# Altium project TS_24_Brake Module.PrjPcb
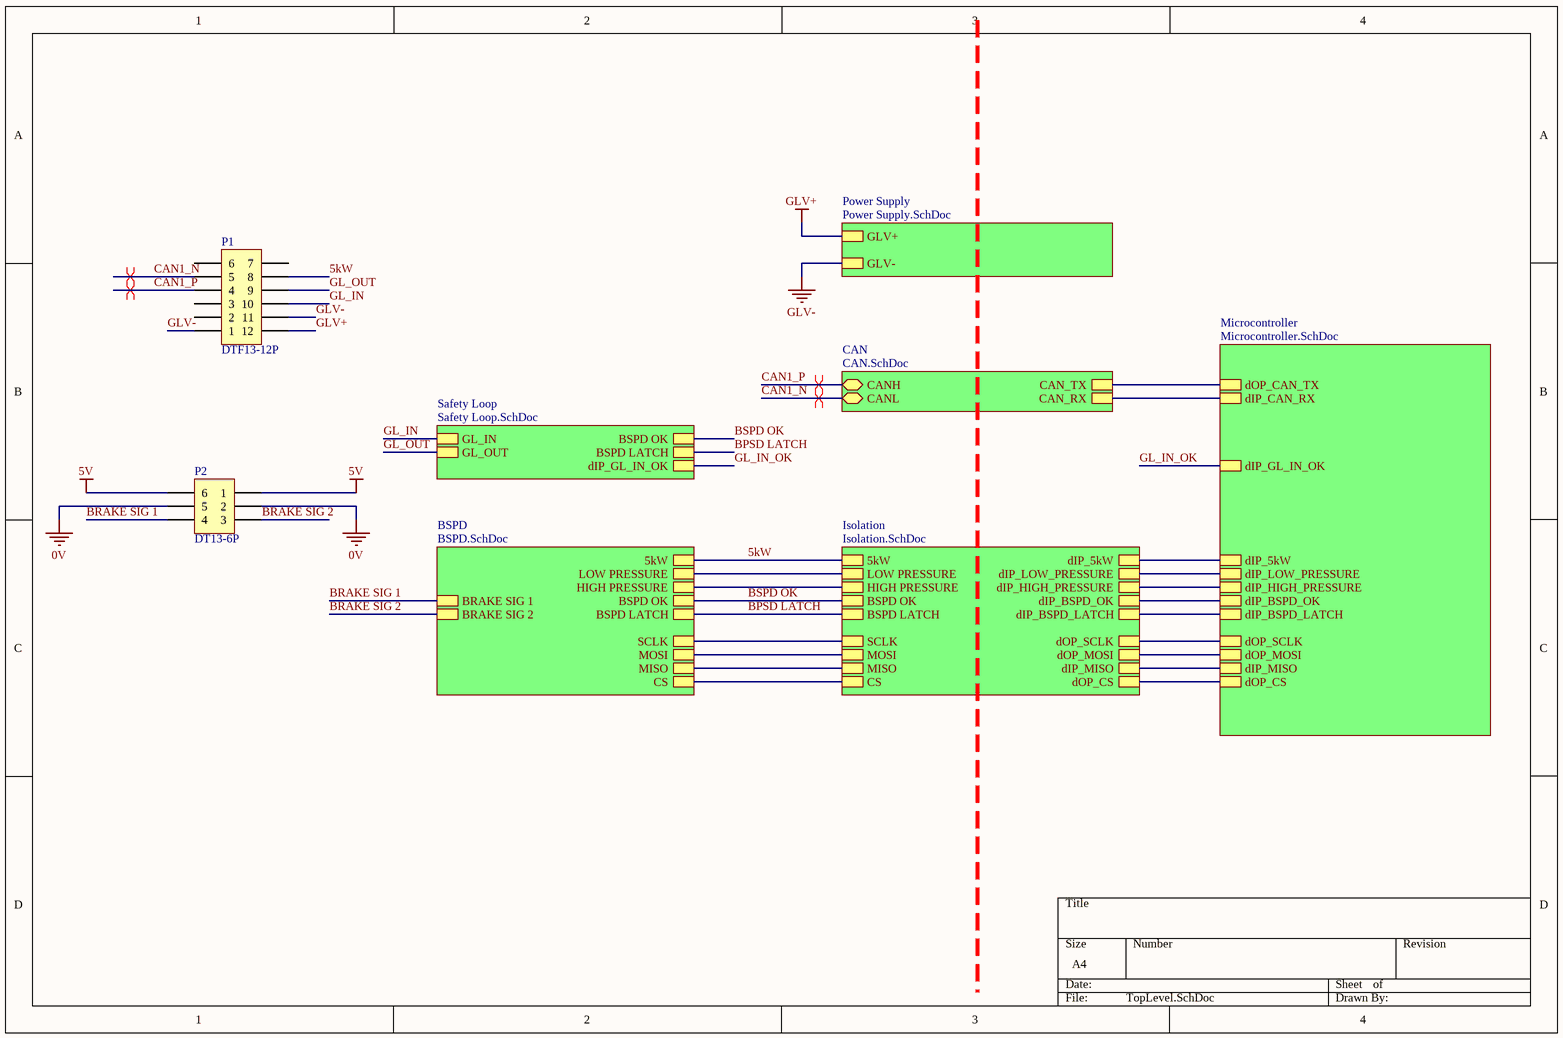
[diagram p0: TopLevel.SchDoc]
7 sheets, 116 parts. Net scope: hierarchical (ports join the sheet entries above them; power ports are global).
Board files: Brake Module A Sample.PcbDoc, Brake Module B1 Sample.PcbDoc, Brake Module B2 Sample.PcbDoc, Brake Module B4.PcbDoc
Sheets:
  TopLevel.SchDoc
    Power Supply = Power Supply.SchDoc
    CAN = CAN.SchDoc
    Isolation = Isolation.SchDoc
    BSPD = BSPD.SchDoc
    Microcontroller = Microcontroller.SchDoc
    Safety Loop = Safety Loop.SchDoc

## Sheet TopLevel.SchDoc
size A4; SheetNumber: 1; SheetTotal: 7

### Parts
P1  DTF13-12P  [DTF13-12P]
P2  DT13-6P  [DTF13-6P]

### Sub-sheets
BSPD = BSPD.SchDoc: 5kW, BSPD OK, BSPD LATCH, SCLK, MOSI, MISO, CS, BRAKE SIG 1, BRAKE SIG 2, HIGH PRESSURE, LOW PRESSURE
CAN = CAN.SchDoc: CANH (bidir), CANL (bidir), CAN_TX, CAN_RX
Isolation = Isolation.SchDoc: 5kW, BSPD OK, BSPD LATCH, SCLK, MOSI, MISO, CS, HIGH PRESSURE, LOW PRESSURE, dIP_5kW, dIP_LOW_PRESSURE, dIP_HIGH_PRESSURE, dIP_BSPD_OK, dIP_BSPD_LATCH, dOP_CS, dOP_MOSI, dIP_MISO, dOP_SCLK
Microcontroller = Microcontroller.SchDoc: dOP_CAN_TX, dIP_CAN_RX, dIP_5kW, dIP_LOW_PRESSURE, dIP_HIGH_PRESSURE, dIP_BSPD_OK, dIP_BSPD_LATCH, dOP_SCLK, dOP_MOSI, dIP_MISO, dOP_CS, dIP_GL_IN_OK
Power Supply = Power Supply.SchDoc: GLV+, GLV-
Safety Loop = Safety Loop.SchDoc: BSPD OK, BSPD LATCH, GL_IN, GL_OUT, dIP_GL_IN_OK

### Nets
0V: P2.2 P2.5
5V: P2.1 P2.6
GLV+: P1.12 ; sheet Power Supply/GLV+
GLV-: P1.1 P1.11 ; sheet Power Supply/GLV-
5kW: P1.8 ; sheet Isolation/5kW, sheet BSPD/5kW
BPSD LATCH: sheet Isolation/BSPD LATCH, sheet BSPD/BSPD LATCH, sheet Safety Loop/BSPD LATCH
BRAKE SIG 1: P2.4 ; sheet BSPD/BRAKE SIG 1
BRAKE SIG 2: P2.3 ; sheet BSPD/BRAKE SIG 2
BSPD OK: sheet Isolation/BSPD OK, sheet BSPD/BSPD OK, sheet Safety Loop/BSPD OK
CAN1_N: P1.5 ; sheet CAN/CANL
CAN1_P: P1.4 ; sheet CAN/CANH
CS (ADC): sheet Isolation/CS, sheet BSPD/CS
GL_IN: P1.10 ; sheet Safety Loop/GL_IN
GL_IN_OK: sheet Microcontroller/dIP_GL_IN_OK, sheet Safety Loop/dIP_GL_IN_OK
GL_OUT: P1.9 ; sheet Safety Loop/GL_OUT
NetADC1_12: sheet Isolation/MISO, sheet BSPD/MISO
NetADC1_13: sheet Isolation/SCLK, sheet BSPD/SCLK
NetADC1_14: sheet Isolation/MOSI, sheet BSPD/MOSI
NetR9_1: sheet CAN/CAN_RX, sheet Microcontroller/dIP_CAN_RX
NetR10_1: sheet CAN/CAN_TX, sheet Microcontroller/dOP_CAN_TX
NetR24_1: sheet Isolation/HIGH PRESSURE, sheet BSPD/HIGH PRESSURE
NetR25_1: sheet Isolation/LOW PRESSURE, sheet BSPD/LOW PRESSURE
NetR34_1: sheet Isolation/dOP_CS, sheet Microcontroller/dOP_CS
NetU7_9: sheet Isolation/dIP_BSPD_OK, sheet Microcontroller/dIP_BSPD_OK
NetU7_10: sheet Isolation/dIP_BSPD_LATCH, sheet Microcontroller/dIP_BSPD_LATCH
NetU7_12: sheet Isolation/dOP_SCLK, sheet Microcontroller/dOP_SCLK
NetU7_13: sheet Isolation/dIP_MISO, sheet Microcontroller/dIP_MISO
NetU7_14: sheet Isolation/dOP_MOSI, sheet Microcontroller/dOP_MOSI
NetU7_15: sheet Isolation/dIP_5kW, sheet Microcontroller/dIP_5kW
NetU7_16: sheet Isolation/dIP_HIGH_PRESSURE, sheet Microcontroller/dIP_HIGH_PRESSURE
NetU7_17: sheet Isolation/dIP_LOW_PRESSURE, sheet Microcontroller/dIP_LOW_PRESSURE

Not connected (* = marked no-connect by the designer): P1 2 3 6 7

### Layout directives
differential pair: CAN1_N, CAN1_P

### Library data of the parts
P1 = DTF13-12P: Positions: 12; Pitch: 4.45mm; Angle: 90; Flange: No; Contact: Copper Alloy; Part Number: DTF13-12P; Row Spacing: 4.45mm; Digikey Part Number: 1734-1861-ND; Digikey Link: https://www.digikey.com/products/en?keywords=dtf13-12pa
P2 = DTF13-6P: Positions: 6; Pitch: 4.45mm; Angle: 90; Flange: No; Contact: Copper Alloy; Part Number: DTF13-6P; Row Spacing: 4.45mm; Digikey Part Number: 1734-1754-ND; Digikey Link: https://www.digikey.com/products/en?keywords=DTF13-6P

## Sheet Power Supply.SchDoc
size A4; SheetNumber: 2; SheetTotal: 7
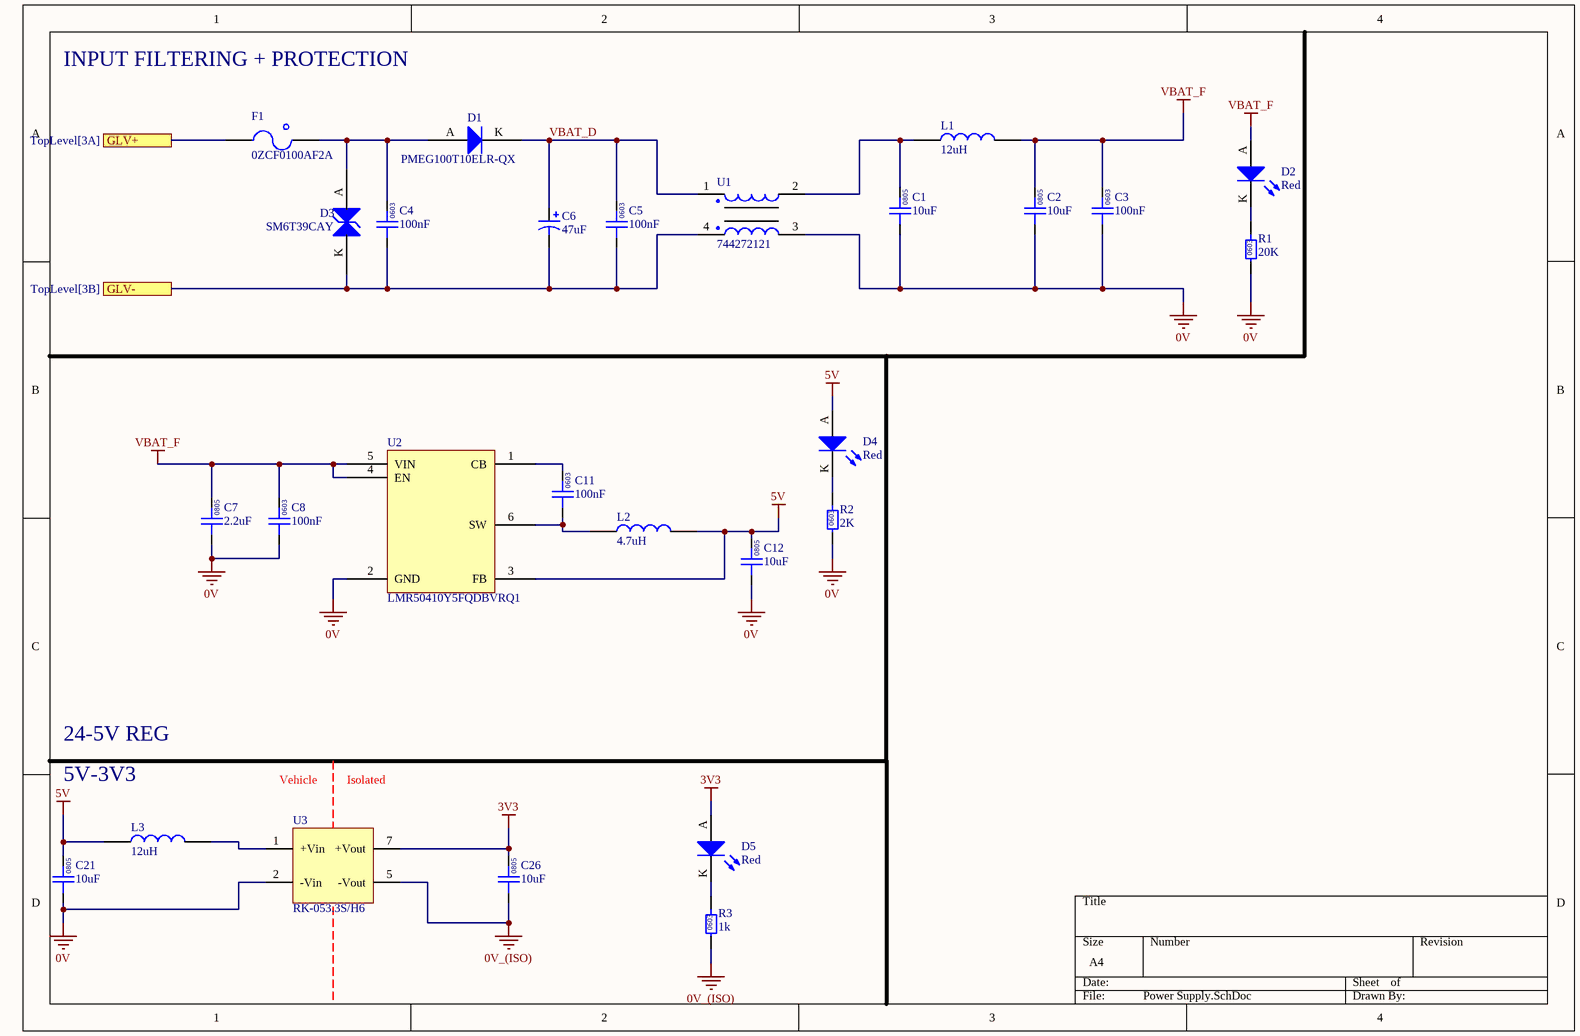
[diagram p1: Power Supply.SchDoc]

### Parts
C1  10uF  [0805]
C2  10uF  [0805]
C3  100nF  [0603]
C4  100nF  [0603]
C5  100nF  [0603]
C6  47uF  [CHEMI-CON ELCO]
C7  2.2uF  [0805]
C8  100nF  [0603]
C11  100nF  [0603]
C12  10uF  [0805]
C21  10uF  [0805]
C26  10uF  [0805]
D1  PMEG100T10ELR-QX  [SODFL350X110-2N]
D2  Red  [0805 LED]
D3  SM6T39CAY  [SM6T39CAY-Footprint-1]
D4  Red  [0805 LED]
D5  Red  [0805 LED]
F1  0ZCF0100AF2A  [2920]
L1  12uH  [1812]
L2  4.7uH  [SRN3015TA-4R7M]
L3  12uH  [1812]
R1  20K  [0603]
R2  2K  [0603]
R3  1k  [0603]
U1  744272121  [Wurth 4-PC Pad]
U2  LMR50410Y5FQDBVRQ1  [TI-SOT23-6]
U3  RK-053.3S/H6  [RK-053.3S/H6]

### Ports
GLV+ (see TopLevel[3A]), GLV- (see TopLevel[3B])

### Nets
0V: C1.1 C2.1 C3.1 C7.1 C8.1 C12.1 C21.1 R1.1 R2.1 U1.3 U2.2(GND) U3.2(-Vin)
0V_(ISO): C26.1 R3.1 U3.5(-Vout)
3V3: C26.2 D5.A U3.7(+Vout)
5V: C12.2 C21.2 D4.A L2.1 L3.2 U2.3(FB)
GLV+: F1.1 ; port GLV+
GLV-: C4.1 C5.1 C6.1 D3.K U1.4 ; port GLV-
VBAT_F: C2.2 C3.2 C7.2 C8.2 D2.A L1.1 U2.4(EN) U2.5(VIN)
VBAT_D: C5.2 C6.2 D1.K U1.1
NetC1_2: C1.2 L1.2 U1.2
NetC4_2: C4.2 D1.A D3.A F1.2
NetC11_1: C11.1 L2.2 U2.6(SW)
NetC11_2: C11.2 U2.1(CB)
NetD2_K: D2.K R1.2
NetD4_K: D4.K R2.2
NetD5_K: D5.K R3.2
NetL3_1: L3.1 U3.1(+Vin)

### Notes on the sheet
- INPUT FILTERING + PROTECTION
- 24-5V REG
- 5V-3V3
- Vehicle
- Isolated
- (in symbol GCM188L81H104KA57D) 0603
- (in symbol GRM21BR6YA106KE43L) 0805
- (in symbol GRM21BR61A226ME51L) 0805
- (in symbol RC0603FR-071KL) 0603
- (in symbol RC0603FR-072KL) 0603
- (in symbol RC0603FR-0720KL) 0603

### Library data of the parts
C1 C2 C12 C21 C26 = GRM21BR6YA106KE43L: Manufacturer: muRata; Rated Voltage: 50V; Tolerance: 10%; Material: MLCC; Temperature Rating: X5R; Part Number: GRM21BR6YA106KE43L; Value: 10uF; Digikey Part Number: 490-10514-6-ND
C3-C5 C8 C11 = GCM188L81H104KA57D: Manufacturer: muRata; Rated Voltage: 50V; Tolerance: ±10%; Material: MLCC; Temperature Rating: X8L; Part Number: GCM188L81H104KA57D; Value: 100nF; Digikey Part Number: 490-6049-1-ND
C6 = HHXA350ARA470MF61G: Part Number: HHXA350ARA470MF61G
C7 = GRM21BR61A226ME51L: Manufacturer: muRata; Value: 22uF; Rated Voltage: 50V; Tolerance: 20%; Material: MLCC; Temperature Rating: X5R; Part Number: GRM21BR61A226ME51L; Digikey Part Number: 490-10511-1-ND
D1 = CMP-004-00005-4: Diode 100 V 1A Surface Mount SOD-123W
D2 D4 D5 = SML-210LTT86: Red LED Indication - Discrete 1.75V 0805 (2012 Metric); Manufacturer: ROHM Semiconductor; Part Number: SML-210LTT86; Colour: Red; Digikey Part Number: 511-1286-1-ND
D3 = CMP-004-00003-4: TVS Diode Single Bi-Dir 33.3V 600W Automotive 2-Pin SMB T/R / TVS DIODE 33.3VWM 69.7VC SMB; Peak Pulse Current: 57A; Polarity: Bidirectional; Min Breakdown Voltage: 37.1V; Test Current: 1mA; Number of Elements: 1; Operating Supply Voltage: 30V; Diode Type: ZENER; Clamping Voltage: 53.9V; Leakage Current: 200nA; Power Line Protection: No; Max Surge Current: 11.1A; Max Breakdown Voltage: 41V; Breakdown Voltage: 39V; Max Power Dissipation: 600W; Radiation Hardening: No; Resistor Type: Zener; Termination: SMD/SMT; REACH SVHC: No SVHC; Reverse Breakdown Voltage: 37.1V; Max Operating Temperature: 150°C; Min Operating Temperature: -55°C; Element Configuration: Single; Length: 4.6mm; Case/Package: DO-214AA; Reverse Standoff Voltage: 33.3V; Number of Bidirectional Channels: 1; Number of Pins: 2; Direction: Bidirectional; Mount: Surface Mount; Package Quantity: 1; Width: 3.95mm; RoHS Compliant: Yes; Number of Channels: 1; Packaging: Tape and Reel; Max Reverse Leakage Current: 200nA; Peak Pulse Power: 600W; Height: 2.45mm; Series: Automotive, AEC-Q101, SM6TY, TRANSIL™
F1 = 0ZCF0100AF2A: PTC RESET FUSE 60V 1A 292; Manufacturer: Littelfuse Inc.; Part Number: 0ZCF0100AF2A; Digikey Part Number: 507-2070-1-ND; Digikey Link: https://www.digikey.com/product-detail/en/bel-fuse-inc/0ZCF0100AF2A/507-2070-1-ND/6210547
L1 L3 = RLS-126: Manufacturer: Recom; Tolerance: 0.2; Impedance: 230mOhm; Rated Current: 0.8 A; Material: Wirewound; Part Number: RLS-126; Value: 12uH; Digikey Part Number: 945-3429-ND
L2 = SRN4018-4R7M: Manufacturer: Bourns; Tolerance: 0.2; Impedance: 84mOhms; Rated Current: 1.9A; Material: Wirewound; Part Number: SRN4018-4R7M; Value: 4.7uH; Digikey Part Number: SRN3015TA-4R7MCT-ND
R1 = RC0603FR-0720KL: Manufacturer: YAGEO; Tolerance: 0.01; Rated Power: 0.1W; Part Number: RC0603FR-0720KL; Value: 20K; Digikey Part Number: 311-20.0KHRCT-ND; Material: FR-07
R2 = RC0603FR-072KL: Manufacturer: YAGEO; Tolerance: 0.01; Rated Power: 0.1W; Part Number: RC0603FR-072KL; Value: 2K; Digikey Part Number: 311-2.00KHRCT-ND; Material: FR-07
R3 = RC0603FR-071KL: Manufacturer: YAGEO; Tolerance: 0.01; Rated Power: 0.1W; Part Number: RC0603FR-071KL; Value: 1k; Digikey Part Number: 311-1.00KHRCT-ND; Material: FR-07
U1 = 744272121: Manufacturer: Wurth Electronics Inc; Value: 120uH @ 100kHz; Impedance: 460 Ohms @ 30MHz; Rated Current: 2.5 A; Part Number: 744272121; Material: Wirewound; Digikey Part Number: 732-1489-1-ND
U2 = LMR50410-Q1: IC REG BUCK 5V 1A SOT23-6; Manufacturer: Texas Instruments; Input Voltage: 4-36V; Part Number: LMR50410-Q1; Output Voltage: 5V; Output Current: 1A; Digikey Part Number: 296-LMR50410Y5FQDBVRQ1CT-ND
U3 = RK-053.3S/H6: DC DC CONVERTER 3.3V 1W; Manufacturer: Recom; Input Voltage: 5V; Output Current: 303mA; Part Number: RK-053.3S/H6; Output Voltage: 3.3V

## Sheet CAN.SchDoc
size A4; SheetNumber: 3; SheetTotal: 7
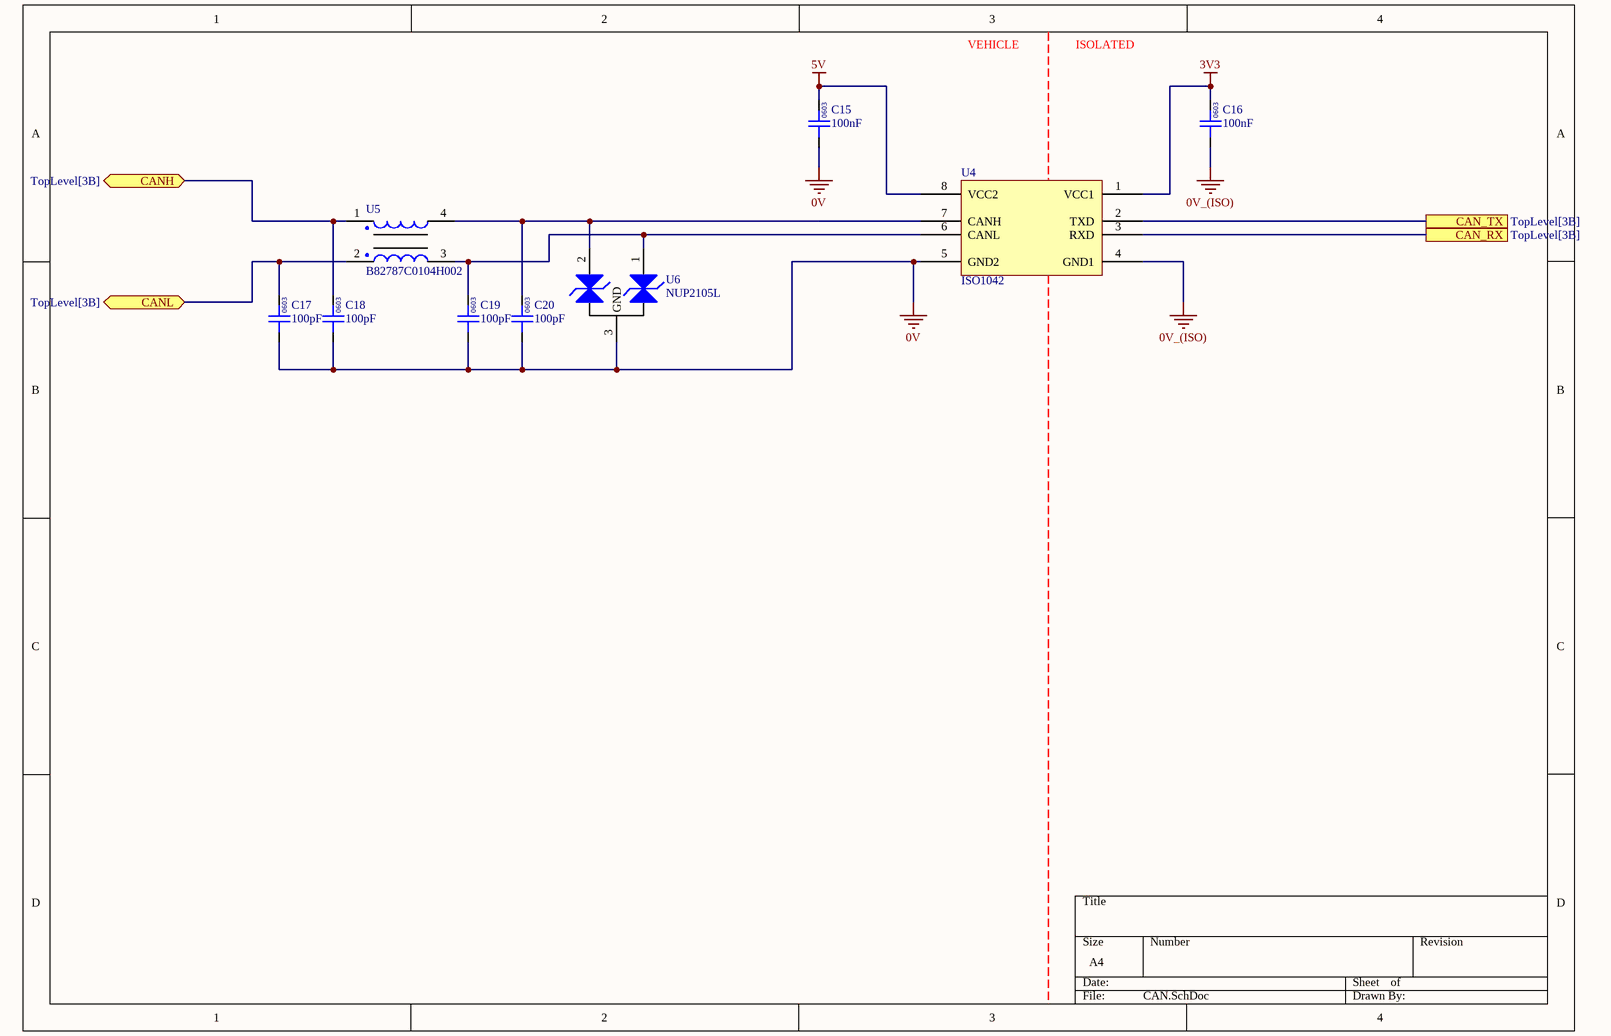
[diagram p2: CAN.SchDoc]

### Parts
C15  100nF  [0603]
C16  100nF  [0603]
C17  100pF  [0603]
C18  100pF  [0603]
C19  100pF  [0603]
C20  100pF  [0603]
U4  ISO1042  [TI-SOIC-8]
U5  B82787C0104H002  [TDK 4-PC Pad]
U6  NUP2105L  [ON SOT-23]

### Ports
CAN_RX (see TopLevel[3B]), CAN_TX (see TopLevel[3B]), CANH (bidir, see TopLevel[3B]), CANL (bidir, see TopLevel[3B])

### Nets
0V: C15.1 C17.1 C18.1 C19.1 C20.1 U4.5(GND2) U6.3(GND)
0V_(ISO): C16.1 U4.4(GND1)
3V3: C16.2 U4.1(VCC1)
5V: C15.2 U4.8(VCC2)
CAN1_N: C17.2 U5.2 ; port CANL
CAN1_P: C18.2 U5.1 ; port CANH
NetC19_2: C19.2 U4.6(CANL) U5.3 U6.1(CAN_H)
NetC20_2: C20.2 U4.7(CANH) U5.4 U6.2(CAN_L)
NetR9_1: U4.3(RXD) ; port CAN_RX
NetR10_1: U4.2(TXD) ; port CAN_TX

### Notes on the sheet
- VEHICLE
- ISOLATED
- (in symbol GCM188L81H104KA57D) 0603
- (in symbol GRM1885C1H101JA01D) 0603

### Library data of the parts
C15 C16 = GCM188L81H104KA57D: as C3 on sheet Power Supply; Part Number: GCM188L81H104KA57D; Value: 100nF; Digikey Part Number: 490-6049-1-ND
C17-C20 = GRM1885C1H101JA01D: Manufacturer: Murata Electronics; Rated Voltage: 50V; Tolerance: ±5%; Material: MLCC; Temperature Rating: C0G, NP0; Part Number: GRM1885C1H101JA01D; Value: 100pF; Digikey Part Number: 490-1427-1-ND
U4 = ISO1042: IC CAN TRANSCEIVER 1/1 8SOIC; Manufacturer: Texas Instruments; Part Number: ISO1042; Digikey Part Number: 296-ISO1042BQDWVQ1-ND
U5 = B82787C0104H002: Manufacturer: EPCOS (TDK); Value: 100µH @ 100kHz; Impedance: 5.8 kOhms @ 10MHz; Rated Current: 150mA; Part Number: B82787C0104H002; Material: Wirewound; Digikey Part Number: 495-4598-1-ND
U6 = NUP2105L: Dual Line CAN Bus Protector; Manufacturer: ON Semiconductor; Part Number: NUP2105L; Digikey Part Number: NUP2105LT1GOSCT-ND; Digikey Link: https://www.digikey.com/product-detail/en/on-semiconductor/NUP2105LT1G/NUP2105LT1GOSCT-ND/1485001

## Sheet Isolation.SchDoc
size A4; SheetNumber: 7; SheetTotal: 7
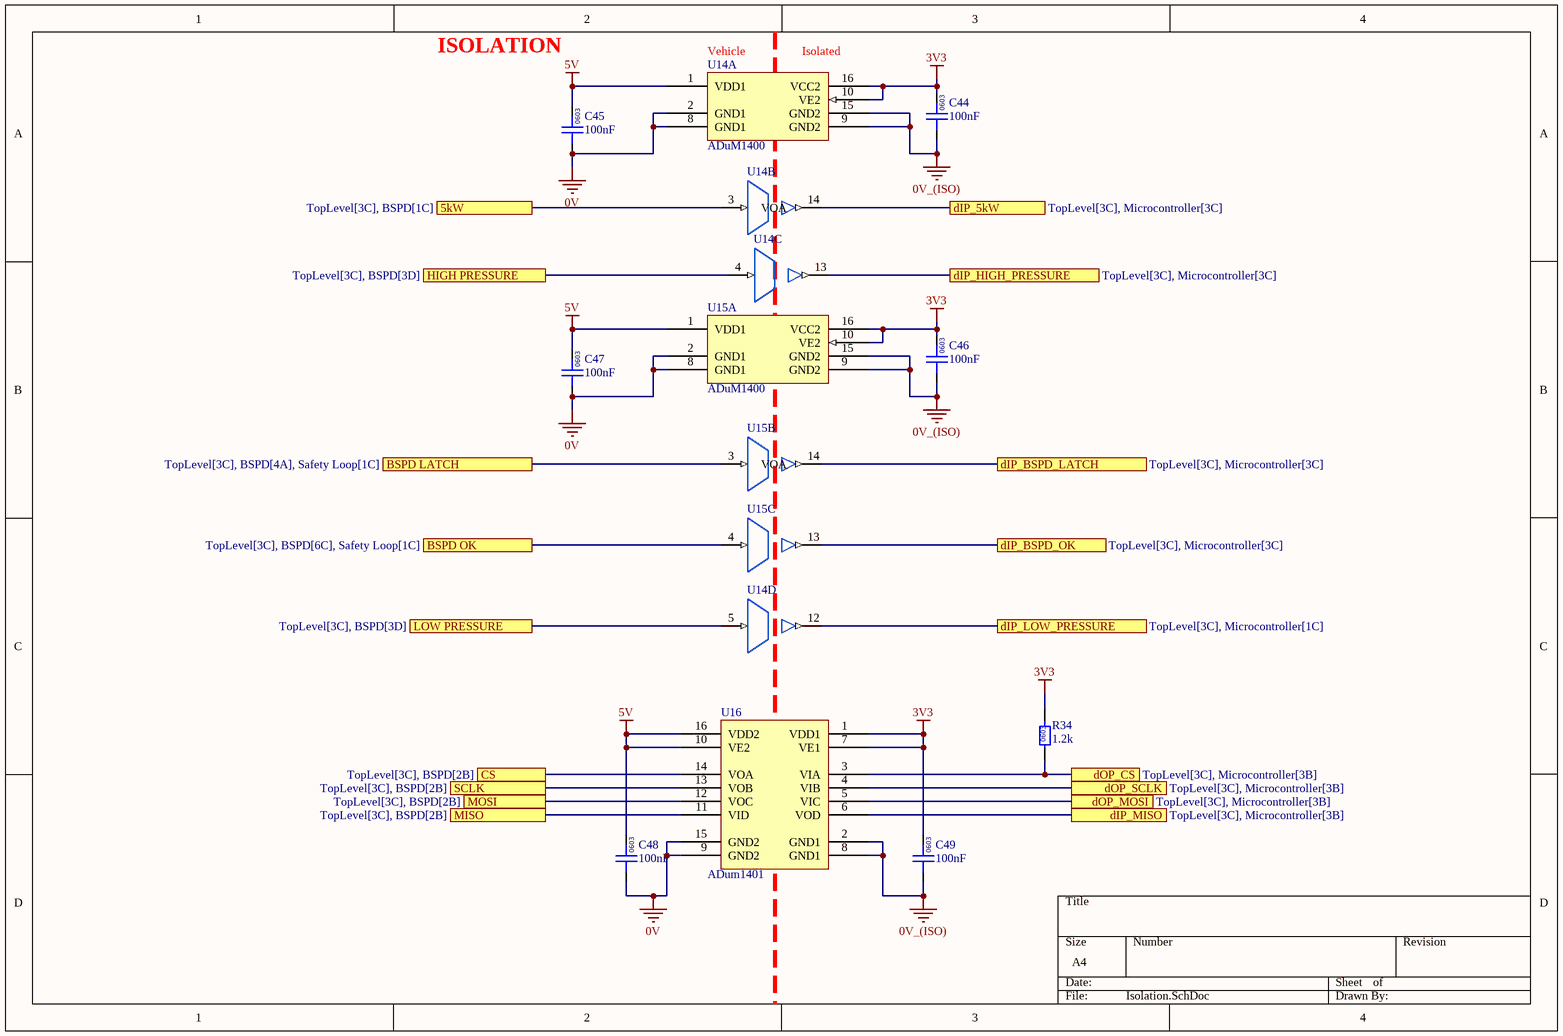
[diagram p3: Isolation.SchDoc]

### Parts
C44  100nF  [0603]
C45  100nF  [0603]
C46  100nF  [0603]
C47  100nF  [0603]
C48  100nF  [0603]
C49  100nF  [0603]
R34  1.2k  [0603]
U14  ADuM1400  [AD 16-SOIC]  (parts A,B,C,D of 5)
U15  ADuM1400  [AD 16-SOIC]  (parts A,B,C of 5)
U16  ADum1401  [AD 16-SOIC]

### Ports
5kW (see TopLevel[3C], BSPD[1C]), BSPD LATCH (see TopLevel[3C], BSPD[4A], Safety Loop[1C]), BSPD OK (see TopLevel[3C], BSPD[6C], Safety Loop[1C]), CS (see TopLevel[3C], BSPD[2B]), dIP_5kW (see TopLevel[3C], Microcontroller[3C]), dIP_BSPD_LATCH (see TopLevel[3C], Microcontroller[3C]), dIP_BSPD_OK (see TopLevel[3C], Microcontroller[3C]), dIP_HIGH_PRESSURE (see TopLevel[3C], Microcontroller[3C]), dIP_LOW_PRESSURE (see TopLevel[3C], Microcontroller[1C]), dIP_MISO (see TopLevel[3C], Microcontroller[3B]), dOP_CS (see TopLevel[3C], Microcontroller[3B]), dOP_MOSI (see TopLevel[3C], Microcontroller[3B]), dOP_SCLK (see TopLevel[3C], Microcontroller[3B]), HIGH PRESSURE (see TopLevel[3C], BSPD[3D]), LOW PRESSURE (see TopLevel[3C], BSPD[3D]), MISO (see TopLevel[3C], BSPD[2B]), MOSI (see TopLevel[3C], BSPD[2B]), SCLK (see TopLevel[3C], BSPD[2B])

### Nets
0V: C45.1 C47.1 C48.1 U14.2(GND1) U14.8(GND1) U15.2(GND1) U15.8(GND1) U16.9(GND2) U16.15(GND2)
0V_(ISO): C44.1 C46.1 C49.1 U14.9(GND2) U14.15(GND2) U15.9(GND2) U15.15(GND2) U16.2(GND1) U16.8(GND1)
3V3: C44.2 C46.2 C49.2 R34.2 U14.10(VE2) U14.16(VCC2) U15.10(VE2) U15.16(VCC2) U16.1(VDD1) U16.7(VE1)
5V: C45.2 C47.2 C48.2 U14.1(VDD1) U15.1(VDD1) U16.10(VE2) U16.16(VDD2)
5kW: U14.3(VIA) ; port 5kW
BPSD LATCH: U15.3(VIA) ; port BSPD LATCH
BSPD OK: U15.4(VIB) ; port BSPD OK
CS (ADC): U16.14(VOA) ; port CS
NetADC1_12: U16.11(VID) ; port MISO
NetADC1_13: U16.13(VOB) ; port SCLK
NetADC1_14: U16.12(VOC) ; port MOSI
NetR24_1: U14.4(VIB) ; port HIGH PRESSURE
NetR25_1: U14.5(VIC) ; port LOW PRESSURE
NetR34_1: R34.1 U16.3(VIA) ; port dOP_CS
NetU7_9: U15.13(VOB) ; port dIP_BSPD_OK
NetU7_10: U15.14(VOA) ; port dIP_BSPD_LATCH
NetU7_12: U16.4(VIB) ; port dOP_SCLK
NetU7_13: U16.6(VOD) ; port dIP_MISO
NetU7_14: U16.5(VIC) ; port dOP_MOSI
NetU7_15: U14.14(VOA) ; port dIP_5kW
NetU7_16: U14.13(VOB) ; port dIP_HIGH_PRESSURE
NetU7_17: U14.12(VOC) ; port dIP_LOW_PRESSURE

### Notes on the sheet
- ISOLATION
- (near U14) Vehicle
- (near U14) Isolated
- (in symbol GCM188L81H104KA57D) 0603
- (in symbol RC0603JR-071K2L) 0603

### Library data of the parts
C44-C49 = GCM188L81H104KA57D: as C3 on sheet Power Supply; Part Number: GCM188L81H104KA57D; Value: 100nF; Digikey Part Number: 490-6049-1-ND
R34 = RC0603JR-071K2L: Manufacturer: YAGEO; Tolerance: 0.01; Rated Power: 0.1W; Part Number: RC0603JR-071K2L; Value: 1.2k; Material: FR-07; Digikey Part Number: 311-1.2KGRCT-ND
U14 U15 = ADuM1400: General Purpose Digital Isolator 2500Vrms 4 Channel 1Mbps 25kV/µs CMTI 16-SOIC (0.295", 7.50mm Width); Manufacturer: Analog Devices; Part Number: ADuM1400; Digikey Part Number: ADUM1400WSRWZ-ND; Digikey Link: https://www.digikey.com/product-detail/en/analog-devices-inc/ADUM1400WSRWZ/ADUM1400WSRWZ-ND/1873713
U16 = ADuM1401: General Purpose Digital Isolator 2500Vrms 4 Channel 1Mbps 25kV/µs CMTI 16-SOIC (0.295", 7.50mm Width); Manufacturer: Analog Devices; Part Number: ADuM1401

## Sheet BSPD.SchDoc
size A3; SheetNumber: 5; SheetTotal: 7
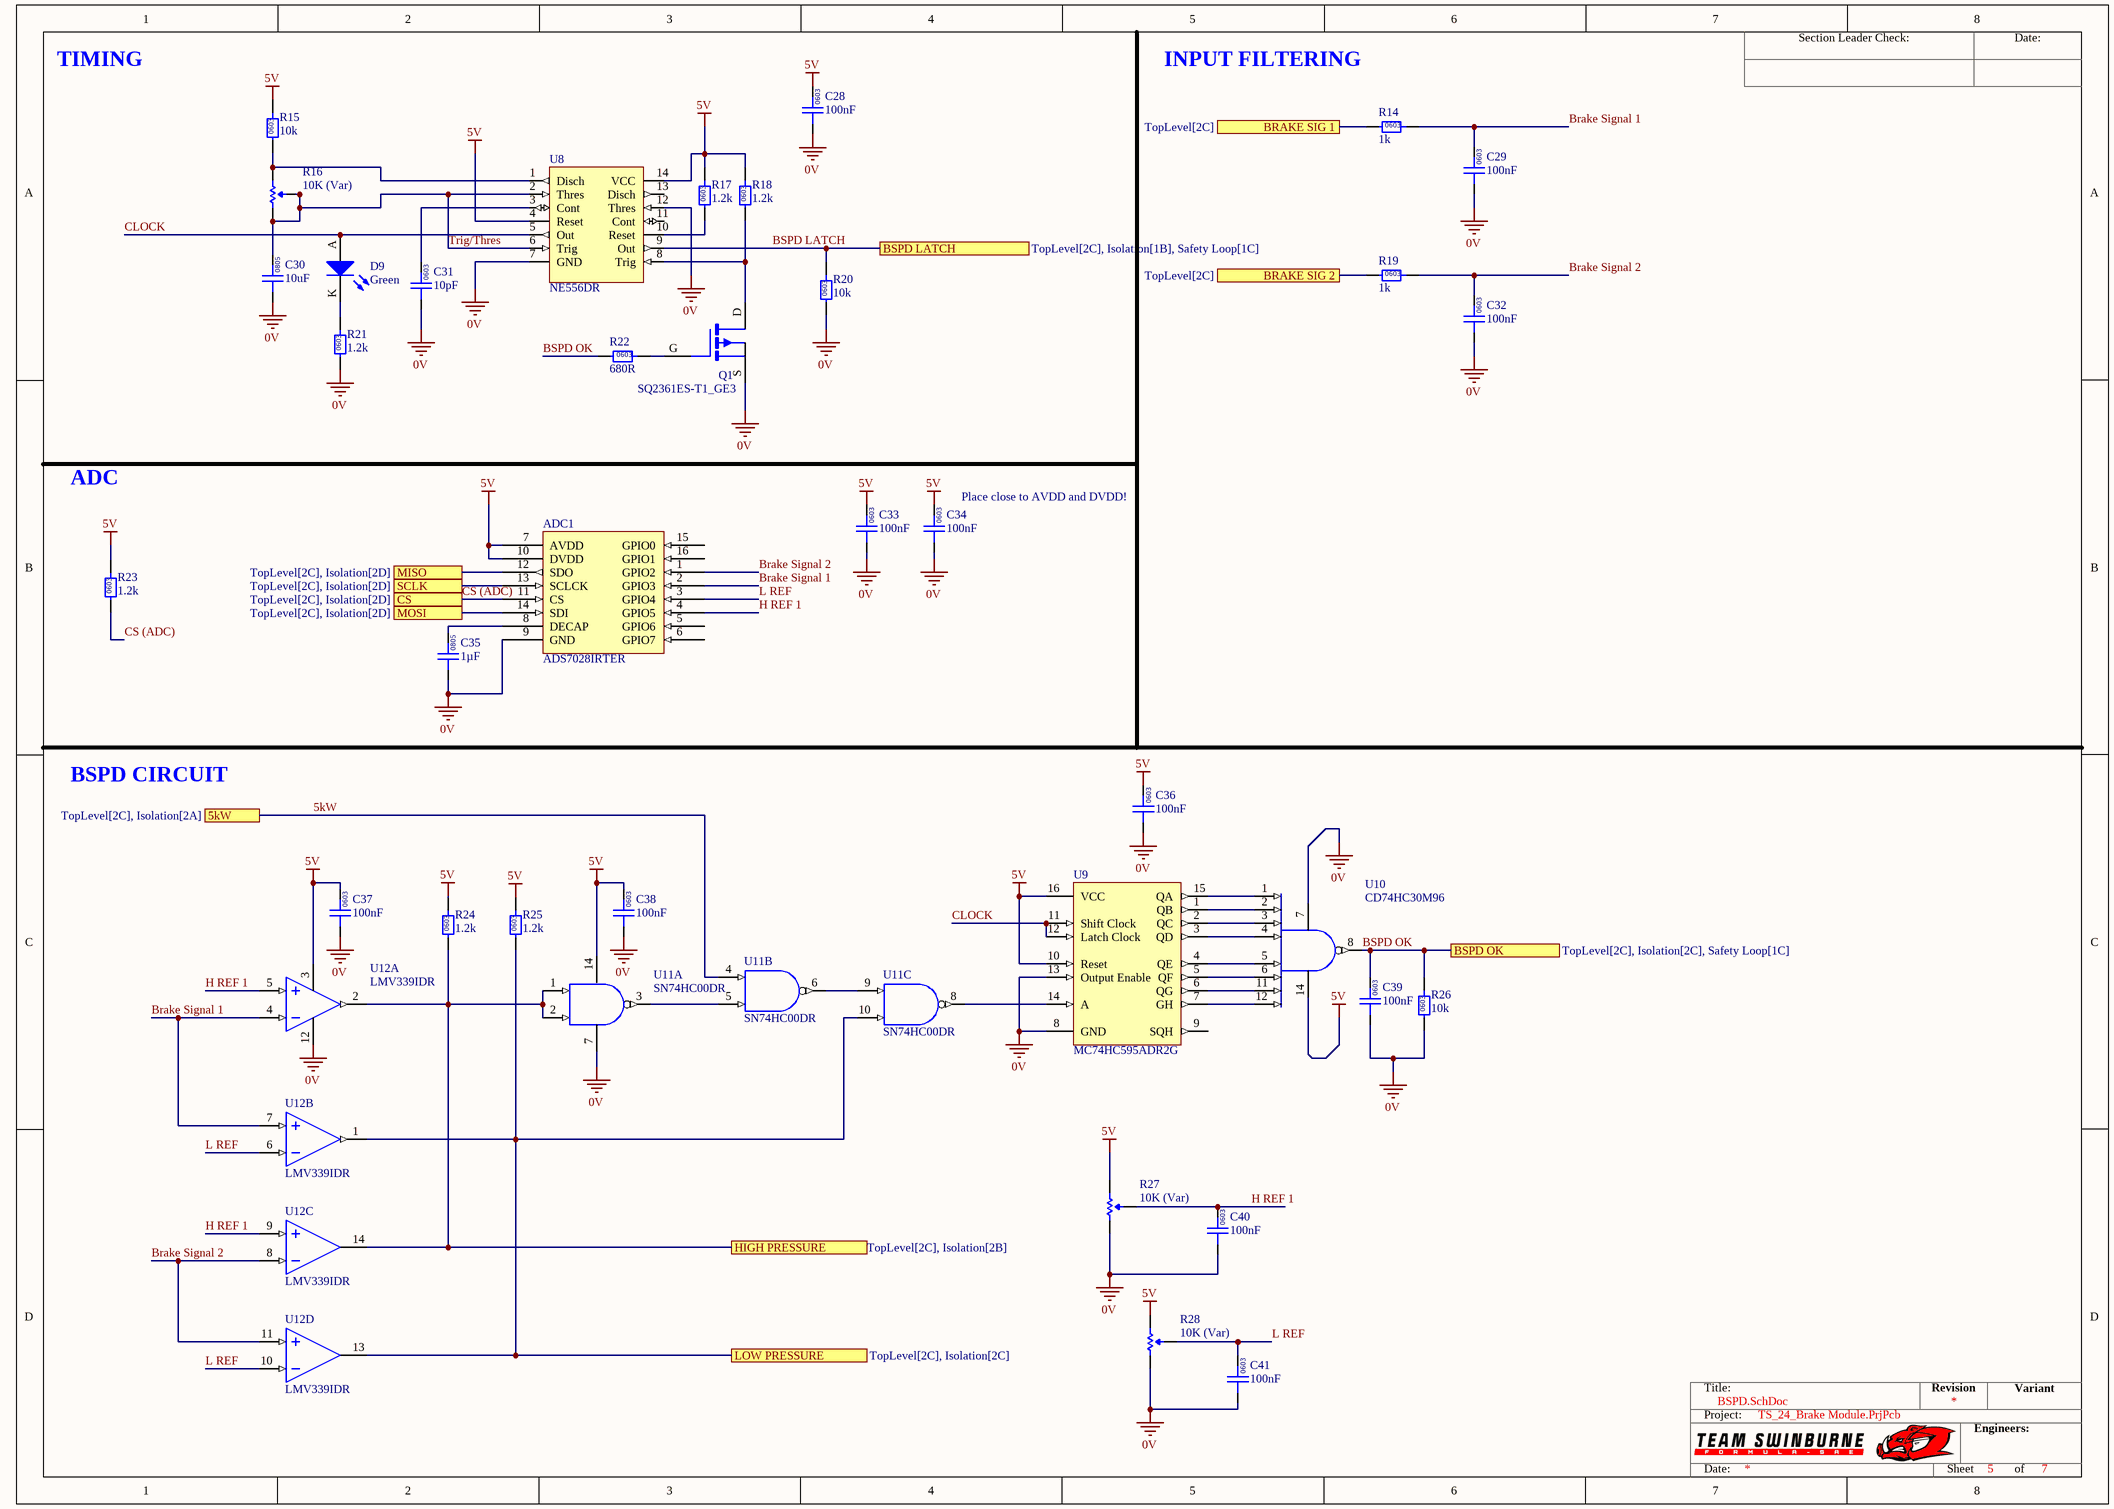
[diagram p4: BSPD.SchDoc]

### Parts
ADC1  ADS7028IRTER  [WFQN-16]
C28  100nF  [0603]
C29  100nF  [0603]
C30  10uF  [0805]
C31  10pF  [0603]
C32  100nF  [0603]
C33  100nF  [0603]
C34  100nF  [0603]
C35  1µF  [0805]
C36  100nF  [0603]
C37  100nF  [0603]
C38  100nF  [0603]
C39  100nF  [0603]
C40  100nF  [0603]
C41  100nF  [0603]
D9  Green  [0805 LED]
Q1  SQ2361ES-T1_GE3  [VSHY SOT-23-3]
R14  1k  [0603]
R15  10k  [0603]
R16  10K (Var)  [B 3296]
R17  1.2k  [0603]
R18  1.2k  [0603]
R19  1k  [0603]
R20  10k  [0603]
R21  1.2k  [0603]
R22  680R  [0603]
R23  1.2k  [0603]
R24  1.2k  [0603]
R25  1.2k  [0603]
R26  10k  [0603]
R27  10K (Var)  [3339P-1-1103LF]
R28  10K (Var)  [3339P-1-1103LF]
U8  NE556DR  [TI-SOIC14]
U9  MC74HC595ADR2G  [ON 16-SOIC]
U10  CD74HC30M96  [TI 14-SOIC]
U11  SN74HC00DR  [TI 14-SOIC]  (parts A,B,C of 4)
U12  LMV339IDR  [TI 14-SOIC]  (parts A,B,C,D of 4)

### Ports
5kW (see TopLevel[2C], Isolation[2A]), BRAKE SIG 1 (see TopLevel[2C]), BRAKE SIG 2 (see TopLevel[2C]), BSPD LATCH (see TopLevel[2C], Isolation[1B], Safety Loop[1C]), BSPD OK (see TopLevel[2C], Isolation[2C], Safety Loop[1C]), CS (see TopLevel[2C], Isolation[2D]), HIGH PRESSURE (see TopLevel[2C], Isolation[2B]), LOW PRESSURE (see TopLevel[2C], Isolation[2C]), MISO (see TopLevel[2C], Isolation[2D]), MOSI (see TopLevel[2C], Isolation[2D]), SCLK (see TopLevel[2C], Isolation[2D])

### Nets
0V: ADC1.9(GND) C28.1 C29.1 C30.1 C31.1 C32.1 C33.1 C34.1 C35.1 C36.1 C37.1 C38.1 C39.1 C40.1 C41.1 Q1.S R20.1 R21.1 R26.1 R27.3(CW) R28.3(CW) U8.7(GND) U8.12(Thres) U9.8(GND) U9.13(Output_Enable) U10.7(GND) U11.7(GND) U12.12(V-)
5V: ADC1.7(AVDD) ADC1.10(DVDD) C28.2 C33.2 C34.2 C36.2 C37.2 C38.2 R15.2 R17.2 R18.2 R23.2 R24.2 R25.2 R27.1(CCW) R28.1(CCW) U8.4(Reset) U8.14(VCC) U9.10(Reset) U9.16(VCC) U10.14(VCC) U11.14(VCC) U12.3(V+)
5kW: U11.4(2A) ; port 5kW
BRAKE SIG 1: R14.1 ; port BRAKE SIG 1
BRAKE SIG 2: R19.1 ; port BRAKE SIG 2
Brake Signal 1: ADC1.2(GPIO3) C29.2 R14.2 U12.4(IN_A-) U12.7(IN_B+)
Brake Signal 2: ADC1.1(GPIO2) C32.2 R19.2 U12.8(IN_C-) U12.11(IN_D+)
BSPD LATCH: R20.2 U8.9(Out) ; port BSPD LATCH  [project net BPSD LATCH]
BSPD OK: C39.2 R22.1 R26.2 U10.8(Output) ; port BSPD OK
CLOCK: D9.A U8.5(Out) U9.11(Shift_Clock) U9.12(Latch_Clock)
CS (ADC): ADC1.11(CS) R23.1 ; port CS
H REF 1: ADC1.4(GPIO5) C40.2 R27.2(Wiper) U12.5(IN_A+) U12.9(IN_C+)
L REF: ADC1.3(GPIO4) C41.2 R28.2(Wiper) U12.6(IN_B-) U12.10(IN_D-)
Trig/Thres: C30.2 R16.2(Wiper) R16.3(CW) U8.2(Thres) U8.6(Trig)
NetADC1_8: ADC1.8(DECAP) C35.2
NetADC1_12: ADC1.12(SDO) ; port MISO
NetADC1_13: ADC1.13(SCLCK) ; port SCLK
NetADC1_14: ADC1.14(SDI) ; port MOSI
NetC31_2: C31.2 U8.3(Cont)
NetD9_K: D9.K R21.2
NetQ1_D: Q1.D R18.1 U8.8(Trig)
NetQ1_G: Q1.G R22.2
NetR15_1: R15.1 R16.1(CCW) U8.1(Disch)
NetR17_1: R17.1 U8.10(Reset)
NetR24_1: R24.1 U11.1(1A) U11.2(1B) U12.2(OUT_A) U12.14(OUT_C) ; port HIGH PRESSURE
NetR25_1: R25.1 U11.10(3B) U12.1(OUT_B) U12.13(OUT_D) ; port LOW PRESSURE
NetU9_1: U9.1(QB) U10.2(Input)
NetU9_2: U9.2(QC) U10.3(Input)
NetU9_3: U9.3(QD) U10.4(Input)
NetU9_4: U9.4(QE) U10.5(Input)
NetU9_5: U9.5(QF) U10.6(Input)
NetU9_6: U9.6(QG) U10.11(Input)
NetU9_7: U9.7(GH) U10.12(Input)
NetU9_14: U9.14(A) U11.8(3Y)
NetU9_15: U9.15(QA) U10.1(Input)
NetU11_3: U11.3(1Y) U11.5(2B)
NetU11_6: U11.6(2Y) U11.9(3A)

Not connected (* = marked no-connect by the designer): ADC1 5(GPIO6) 6(GPIO7) 15(GPIO0) 16(GPIO1); U8 11(Cont) 13(Disch); U9 9(SQH)

### Notes on the sheet
- TIMING
- INPUT FILTERING
- ADC
- (near C34) Place close to AVDD and DVDD!
- BSPD CIRCUIT
- Section Leader Check:
- Date:
- Title:
- Revision
- Variant
- Project:
- Engineers:
- Sheet
- of
- (in symbol GCM21BR71H105KA03L) 0805
- (in symbol GCM188L81H104KA57D) 0603
- (in symbol GRM21BR6YA106KE43L) 0805
- (in symbol GRM1885C1H100JA01D) 0603
- (in symbol RC0603FR-071KL) 0603
- (in symbol RC0603FR-0710KL) 0603
- (in symbol RC0603JR-071K2L) 0603
- (in symbol RC0603JR-13680RL) 0603

### Library data of the parts
ADC1 = ADS7028IRTER: IC ADC 12BIT SAR 16WQFN; Manufacturer: Texas Instruments; Part Number: ADS7028IRTER; Digikey Part Number: ADS7028IRTER; Digikey Link: https://www.digikey.com.au/en/products/detail/texas-instruments/ADS7028IRTER/12696020?s=N4IgTCBcDaIIIBEDKB2ADGAHASQEoBUBRXEAXQF8g
C28 C29 C32-C34 C36-C41 = GCM188L81H104KA57D: as C3 on sheet Power Supply; Part Number: GCM188L81H104KA57D; Value: 100nF; Digikey Part Number: 490-6049-1-ND
C30 = GRM21BR6YA106KE43L: as C1 on sheet Power Supply; Part Number: GRM21BR6YA106KE43L; Value: 10uF; Digikey Part Number: 490-10514-6-ND
C31 = GRM1885C1H100JA01D: Manufacturer: Murata Electronics; Rated Voltage: 50V; Tolerance: ±5%; Material: MLCC; Temperature Rating: C0G, NP0; Part Number: GRM1885C1H100JA01D; Value: 10pF; Digikey Part Number: 490-1403-1-ND
C35 = GCM21BR71H105KA03L: Manufacturer: muRata; Rated Voltage: 50V; Tolerance: ±10%; Material: MLCC; Temperature Rating: X7R; Part Number: GCM21BR71H105KA03L; Value: 1µF; Digikey Part Number: 490-10675-1-ND
D9 = SML-210FTT86: Green LED Indication - Discrete 1.75V 0805 (2012 Metric); Manufacturer: ROHM Semiconductor; Part Number: SML-210FTT86; Colour: Green; Digikey Part Number: 511-1285-1-ND
Q1 = SQ2361ES-T1_GE3: MOSFET P-CH 60V 2.8A SSOT23; Manufacturer: Vishay Siliconix; Type: P-channel; Rated Power: 2 W; Published: 24-Mar-1999; LatestRevisionDate: 29-May-2009; LatestRevisionNote: IPC-7351 Footprint Added.; PackageVersion: Sep-2000; PackageReference: SOT-343; Publisher: Altium Limited; PackageDescription: 4-Pin SOT-343 Package 1.3 mm Pitch, 2.1 mm Lead Span; Part Number: SQ2361ES-T1_GE3; Digikey Part Number: SQ2361ES-T1_GE3CT-ND
R14 R19 = RC0603FR-071KL: as R3 on sheet Power Supply; Part Number: RC0603FR-071KL; Value: 1k; Material: FR-07; Digikey Part Number: 311-1.00KHRCT-ND
R15 R20 R26 = RC0603FR-0710KL: Manufacturer: YAGEO; Tolerance: 0.01; Rated Power: 0.1W; Part Number: RC0603FR-0710KL; Value: 10k; Material: FR-07; Digikey Part Number: 311-10.0KHRCT-ND
R16 = 3296W-1-103LF: Manufacturer: Bournes Inc; Tolerance: 0.1; Rated Power: 0.5W; Part Number: 3296W-1-103LF; Value: 10K (Var); Digikey Part Number: 3296W-103LF-ND
R17 R18 R21 R23-R25 = RC0603JR-071K2L: as R34 on sheet Isolation; Part Number: RC0603JR-071K2L; Value: 1.2k; Material: FR-07; Digikey Part Number: 311-1.2KGRCT-ND
R22 = RC0603JR-13680RL: Manufacturer: YAGEO; Tolerance: 0.01; Rated Power: 0.1W; Part Number: RC0603JR-13680RL; Value: 680R; Material: FR-07; Digikey Part Number: 13-RC0603JR-13680RLCT-ND
R27 R28 = 3339P-1-1103LF: Manufacturer: Bournes Inc; Tolerance: 0.1; Rated Power: 0.5W; Part Number: 3339P-1-1103LF; Value: 10K (Var)
U8 = NE556DR: IC OSC TIMER DUAL 100KHZ 14SOIC; Manufacturer: Texas Instruments; Part Number: NE556DR; Digikey Part Number: 296-26240-1-ND; Digikey Link: https://www.digikey.com.au/en/products/detail/texas-instruments/ne556dr/1571975
U9 = CMP-022-000000-1: IC SHIFT REGISTR 8BIT 3ST 16SOIC; Part Number: MC74HC595ADR2G
U10 = CMP-022-000012-1: IC GATE NAND 1CH 8-INP 14SOIC; Part Number: CD74HC30M96
U11 = CMP-022-000002-1: NAND Gate IC 4 Channel 14-SOIC; Part Number: SN74HC00DR
U12 = CMP-022-000001-1: Comparator General Purpose Open Collector 14-SOIC; Part Number: LMV339IDR

## Sheet Microcontroller.SchDoc
size A4; SheetNumber: 4; SheetTotal: 7
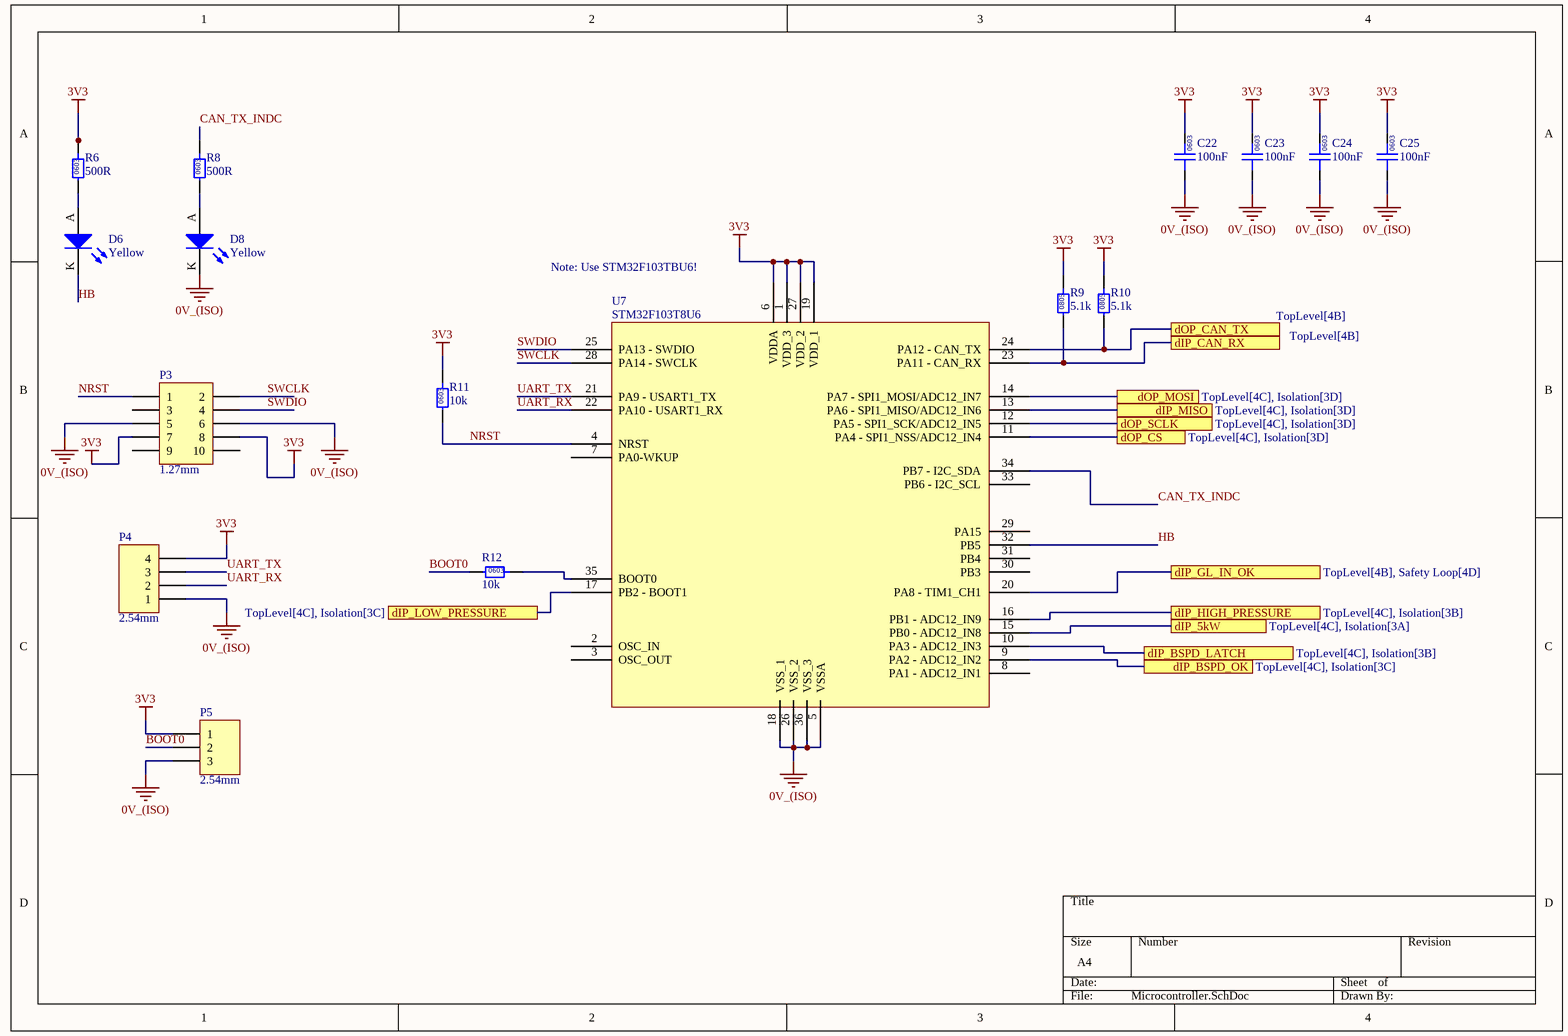
[diagram p5: Microcontroller.SchDoc]

### Parts
C22  100nF  [0603]
C23  100nF  [0603]
C24  100nF  [0603]
C25  100nF  [0603]
D6  Yellow  [0805 LED]
D8  Yellow  [0805 LED]
P3  1.27mm  [3221-10-0300-00]
P4  2.54mm  [TH 2.54mm Header 1x4]
P5  2.54mm  [TH 2.54mm Header 1x3]
R6  500R  [0603]
R8  500R  [0603]
R9  5.1k  [0805]
R10  5.1k  [0805]
R11  10k  [0603]
R12  10k  [0603]
U7  STM32F103T8U6  [STM_QFN-36]

### Ports
dIP_5kW (see TopLevel[4C], Isolation[3A]), dIP_BSPD_LATCH (see TopLevel[4C], Isolation[3B]), dIP_BSPD_OK (see TopLevel[4C], Isolation[3C]), dIP_CAN_RX (see TopLevel[4B]), dIP_GL_IN_OK (see TopLevel[4B], Safety Loop[4D]), dIP_HIGH_PRESSURE (see TopLevel[4C], Isolation[3B]), dIP_LOW_PRESSURE (see TopLevel[4C], Isolation[3C]), dIP_MISO (see TopLevel[4C], Isolation[3D]), dOP_CAN_TX (see TopLevel[4B]), dOP_CS (see TopLevel[4C], Isolation[3D]), dOP_MOSI (see TopLevel[4C], Isolation[3D]), dOP_SCLK (see TopLevel[4C], Isolation[3D])

### Nets
0V_(ISO): C22.1 C23.1 C24.1 C25.1 D8.K P3.5 P3.6 P4.1 P5.3 U7.5(VSSA) U7.18(VSS_1) U7.26(VSS_2) U7.36(VSS_3)
3V3: C22.2 C23.2 C24.2 C25.2 P3.7 P3.8 P4.4 P5.1 R6.2 R9.2 R10.2 R11.2 U7.1(VDD_3) U7.6(VDDA) U7.19(VDD_1) U7.27(VDD_2)
BOOT0: P5.2 R12.1
CAN_TX_INDC: R8.2 U7.34(PB7_-_I2C_SDA)
GL_IN_OK: U7.20(PA8_-_TIM1_CH1) ; port dIP_GL_IN_OK
HB: D6.K U7.32(PB5)
NRST: P3.1 R11.1 U7.4(NRST)
SWCLK: P3.2 U7.28(PA14_-_SWCLK)
SWDIO: P3.4 U7.25(PA13_-_SWDIO)
UART_RX: P4.2 U7.22(PA10_-_USART1_RX)
UART_TX: P4.3 U7.21(PA9_-_USART1_TX)
NetD6_A: D6.A R6.1
NetD8_A: D8.A R8.1
NetR9_1: R9.1 U7.23(PA11_-_CAN_RX) ; port dIP_CAN_RX
NetR10_1: R10.1 U7.24(PA12_-_CAN_TX) ; port dOP_CAN_TX
NetR12_2: R12.2 U7.35(BOOT0)
NetR34_1: U7.11(PA4_-_SPI1_NSS/ADC12_IN4) ; port dOP_CS
NetU7_9: U7.9(PA2_-_ADC12_IN2) ; port dIP_BSPD_OK
NetU7_10: U7.10(PA3_-_ADC12_IN3) ; port dIP_BSPD_LATCH
NetU7_12: U7.12(PA5_-_SPI1_SCK/ADC12_IN5) ; port dOP_SCLK
NetU7_13: U7.13(PA6_-_SPI1_MISO/ADC12_IN6) ; port dIP_MISO
NetU7_14: U7.14(PA7_-_SPI1_MOSI/ADC12_IN7) ; port dOP_MOSI
NetU7_15: U7.15(PB0_-_ADC12_IN8) ; port dIP_5kW
NetU7_16: U7.16(PB1_-_ADC12_IN9) ; port dIP_HIGH_PRESSURE
NetU7_17: U7.17(PB2_-_BOOT1) ; port dIP_LOW_PRESSURE

Not connected (* = marked no-connect by the designer): P3 3 9 10; U7 2(OSC_IN) 3(OSC_OUT) 7(PA0-WKUP) 8(PA1_-_ADC12_IN1) 29(PA15) 30(PB3) 31(PB4) 33(PB6_-_I2C_SCL)

### Notes on the sheet
- (near U7) Note: Use STM32F103TBU6!
- (in symbol GCM188L81H104KA57D) 0603
- (in symbol RC0603FR-0710KL) 0603
- (in symbol RC0805FR075K1L) 0805
- (in symbol RT0603BRD07500RL) 0603

### Library data of the parts
C22-C25 = GCM188L81H104KA57D: as C3 on sheet Power Supply; Part Number: GCM188L81H104KA57D; Value: 100nF; Digikey Part Number: 490-6049-1-ND
D6 D8 = SML-211YTT86: Yellow LED Indication - Discrete 1.75V 0805 (2012 Metric); Manufacturer: ROHM Semiconductor; Part Number: SML-211YTT86; Colour: Yellow; Digikey Part Number: 511-1293-1-ND
P3 = SMD 1.27mm Header 2x5 (3221-10-0300-00): Positions: 10; Angle: 0; Flange: No; Contact: NA; Part Number: SMD 1.27mm Header 2x5 (3221-10-0300-00); Pitch: 1.27mm; Row Spacing: 1.27mm
P4 = TH 2.54mm Header 1x4: Positions: 4; Angle: 0; Flange: No; Contact: NA; Part Number: TH 2.54mm Header 1x4; Pitch: 2.54mm; Row Spacing: 2.54mm
P5 = TH 2.54mm Header 1x3: Positions: 3; Angle: 0; Flange: No; Contact: NA; Part Number: TH 2.54mm Header 1x3; Pitch: 2.54mm; Row Spacing: 2.54mm
R6 R8 = RT0603BRD07500RL: Manufacturer: YAGEO; Tolerance: 0.01; Rated Power: 0.1W; Part Number: RT0603BRD07500RL; Value: 500R; Material: FR-07; Digikey Part Number: 13-RT0603BRD07500RL-ND
R9 R10 = RC0805FR075K1L: Manufacturer: YAGEO; Tolerance: 0.01; Rated Power: 0.125W; Part Number: RC0805FR075K1L; Value: 5.1k; Material: FR-07; Digikey Part Number: 311-5.10KCRCT-ND
R11 R12 = RC0603FR-0710KL: as R15 on sheet BSPD; Part Number: RC0603FR-0710KL; Value: 10k; Digikey Part Number: 311-10.0KHRCT-ND; Material: FR-07
U7 = STM32F103T8U6: ARM® Cortex®-M3 STM32F1 Microcontroller IC 32-Bit 72MHz 64KB (64K x 8) FLASH QFN; Manufacturer: ST Microelectronics; Part Number: STM32F103T8U6; Digikey Part Number: STM32F103T8U6; Digikey Link: https://www.digikey.com/en/products/detail/stmicroelectronics/stm32f103t8u6/1852493

## Sheet Safety Loop.SchDoc
size A4; SheetNumber: 6; SheetTotal: 7
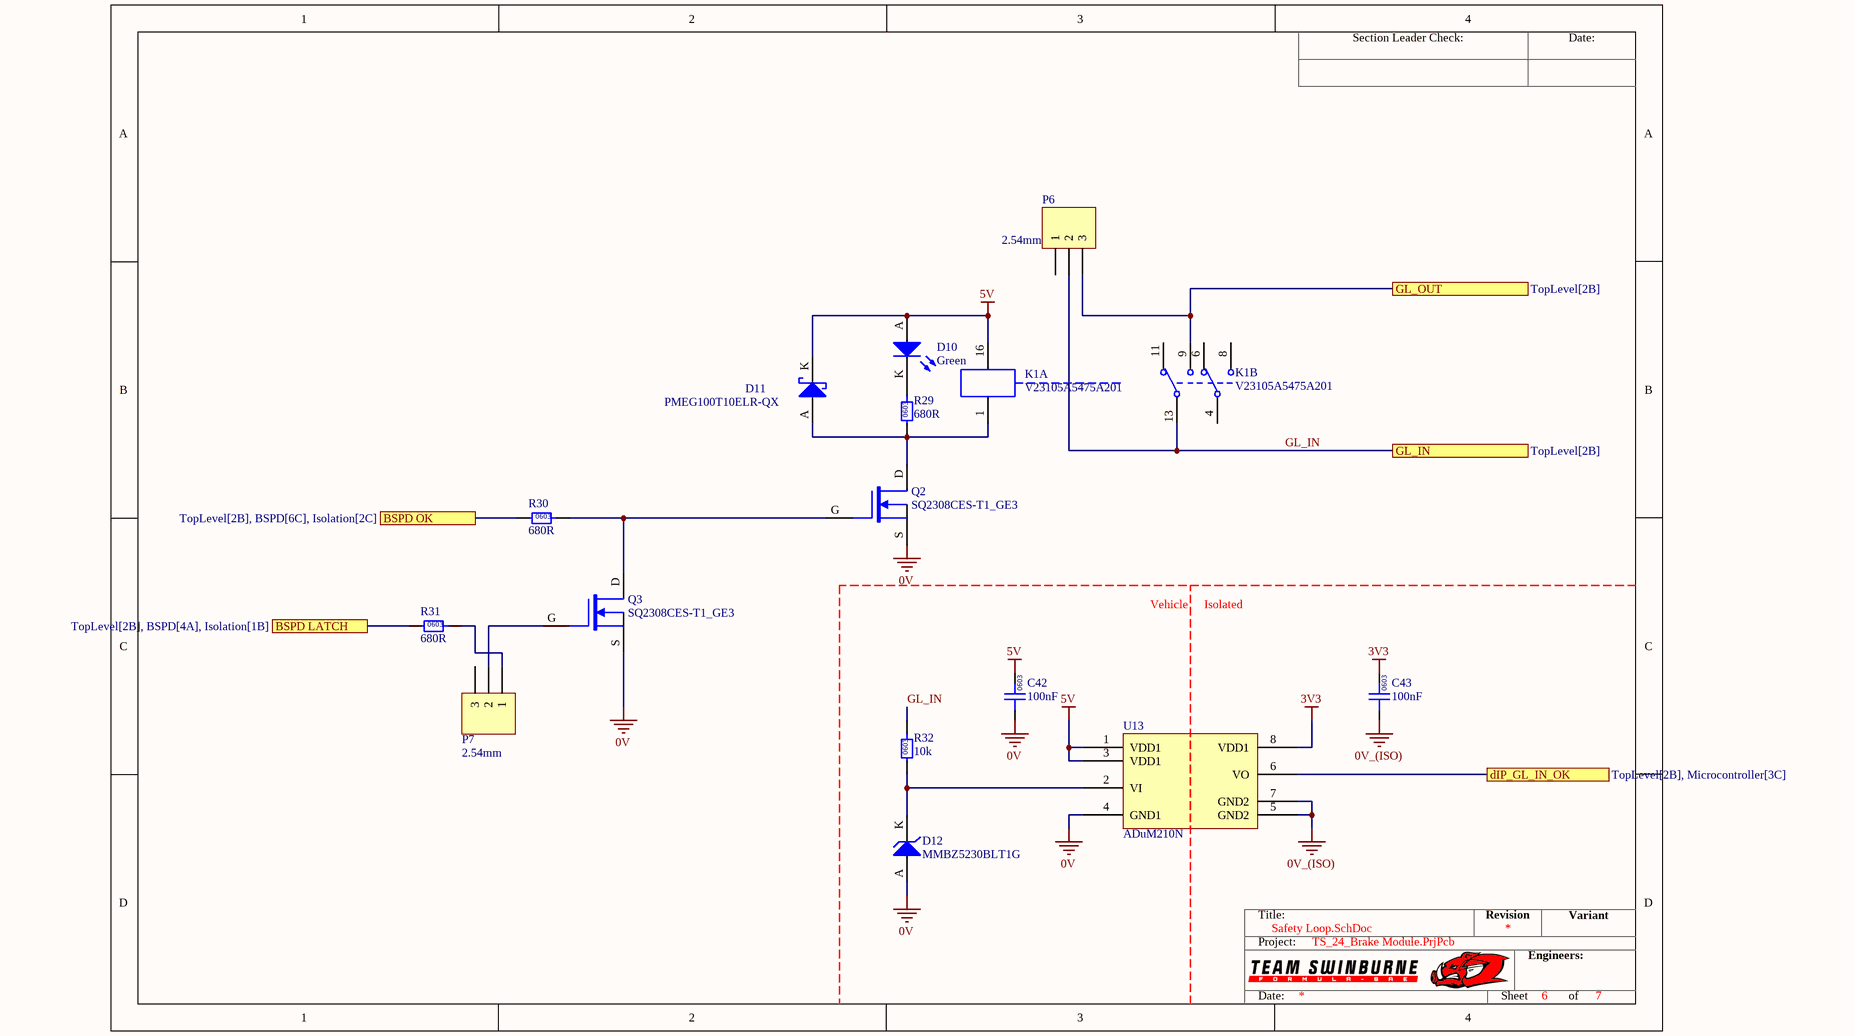
[diagram p6: Safety Loop.SchDoc]

### Parts
C42  100nF  [0603]
C43  100nF  [0603]
D10  Green  [0805 LED]
D11  PMEG100T10ELR-QX  [NXP SOD123W]
D12  MMBZ5230BLT1G  [NEXPERIA_SOT23]
K1  V23105A5475A201  [TI 2-DIL]  (parts A,B of 2)
P6  2.54mm  [TH 2.54mm Header 1x3]
P7  2.54mm  [TH 2.54mm Header 1x3]
Q2  SQ2308CES-T1_GE3  [VSHY SOT-23-3]
Q3  SQ2308CES-T1_GE3  [VSHY SOT-23-3]
R29  680R  [0603]
R30  680R  [0603]
R31  680R  [0603]
R32  10k  [0603]
U13  ADuM210N  [AD-SOIC-8W]

### Ports
BSPD LATCH (see TopLevel[2B], BSPD[4A], Isolation[1B]), BSPD OK (see TopLevel[2B], BSPD[6C], Isolation[2C]), dIP_GL_IN_OK (see TopLevel[2B], Microcontroller[3C]), GL_IN (see TopLevel[2B]), GL_OUT (see TopLevel[2B])

### Nets
0V: C42.1 D12.A Q2.S Q3.S U13.4(GND1)
0V_(ISO): C43.1 U13.5(GND2) U13.7(GND2)
3V3: C43.2 U13.8(VDD1)
5V: C42.2 D10.A D11.K K1.16 U13.1(VDD1) U13.3(VDD1)
BPSD LATCH: R31.1 ; port BSPD LATCH
BSPD OK: R30.1 ; port BSPD OK
GL_IN: K1.13 P6.2 R32.2 ; port GL_IN
GL_IN_OK: U13.6(VO) ; port dIP_GL_IN_OK
GL_OUT: K1.9 P6.3 ; port GL_OUT
NetD10_K: D10.K R29.2
NetD11_A: D11.A K1.1 Q2.D R29.1
NetD12_K: D12.K R32.1 U13.2(VI)
NetP7_1: P7.1 R31.2
NetP7_2: P7.2 Q3.G
NetQ2_G: Q2.G Q3.D R30.2

Not connected (* = marked no-connect by the designer): K1 4 6 8 11; P6 1; P7 3

### Notes on the sheet
- Vehicle
- Isolated
- Section Leader Check:
- Date:
- Title:
- Revision
- Variant
- Project:
- Engineers:
- Sheet
- of
- (in symbol GCM188L81H104KA57D) 0603
- (in symbol RC0603FR-0710KL) 0603
- (in symbol RC0603JR-13680RL) 0603

### Library data of the parts
C42 C43 = GCM188L81H104KA57D: as C3 on sheet Power Supply; Part Number: GCM188L81H104KA57D; Value: 100nF; Digikey Part Number: 490-6049-1-ND
D10 = SML-210FTT86: as D9 on sheet BSPD; Part Number: SML-210FTT86; Colour: Green; Digikey Part Number: 511-1285-1-ND
D11 = PMEG100T10ELR-QX: Manufacturer: Nexperia USA Inc.; Forward Voltage: 0.75 V @ 1A; Breakdown Voltage: 100 V; Rated Power: 680 mW; Part Number: PMEG100T10ELR-QX; Digikey Part Number: 1727-PMEG100T10ELR-QXCT-ND
D12 = MMBZ5230BLT1G: Manufacturer: onsemi; Breakdown Voltage: 4.7V; Rated Power: 225mW; Part Number: MMBZ5230BLT1G; Digikey Part Number: MMBZ5230BLT1GOSTR-ND
K1 = V23105A5475A201: 5V DPDT Relay 3A 220VDC; Manufacturer: Axicom; Part Number: V23105A5475A201; Digikey Part Number: PB383-ND; Digikey Link: https://www.digikey.com/products/en?mpart=V23105A5001A201&v=41
P6 P7 = TH 2.54mm Header 1x3: as P5 on sheet Microcontroller; Part Number: TH 2.54mm Header 1x3; Pitch: 2.54mm; Row Spacing: 2.54mm
Q2 Q3 = SQ2308CES-T1_GE3: MOSFET N-CH 60V 2.3A SOT23; Manufacturer: Vishay Siliconix; Type: N-channel; Rated Power: 2W; Published: 24-Mar-1999; LatestRevisionDate: 29-May-2009; LatestRevisionNote: IPC-7351 Footprint Added.; PackageVersion: Sep-2000; PackageReference: SOT-343; Publisher: Altium Limited; PackageDescription: 4-Pin SOT-343 Package 1.3 mm Pitch, 2.1 mm Lead Span; Part Number: SQ2308CES-T1_GE3; Digikey Part Number: SQ2308CES-T1_GE3CT-ND
R29-R31 = RC0603JR-13680RL: as R22 on sheet BSPD; Part Number: RC0603JR-13680RL; Value: 680R; Material: FR-07; Digikey Part Number: 13-RC0603JR-13680RLCT-ND
R32 = RC0603FR-0710KL: as R15 on sheet BSPD; Part Number: RC0603FR-0710KL; Value: 10k; Material: FR-07; Digikey Part Number: 311-10.0KHRCT-ND
U13 = ADuM210N: DGTL ISO 5000VRMS 1CH GP 8SOIC; Manufacturer: Analogue Devices; Part Number: ADuM210N; Digikey Part Number: ADUM210N1BRIZ-ND; Digikey Link: https://www.analog.com/media/en/technical-documentation/data-sheets/ADuM210N.pdf

## Nets that join several sheets
0V: TopLevel (P2.2 P2.5), Power Supply (12 pins), CAN (7 pins), Isolation (9 pins), BSPD (28 pins), Safety Loop (5 pins)
0V_(ISO): Power Supply (C26.1 R3.1 U3.5), CAN (C16.1 U4.4), Isolation (9 pins), Microcontroller (13 pins), Safety Loop (C43.1 U13.5 U13.7)
3V3: Power Supply (C26.2 D5.A U3.7), CAN (C16.2 U4.1), Isolation (10 pins), Microcontroller (16 pins), Safety Loop (C43.2 U13.8)
5V: TopLevel (P2.1 P2.6), Power Supply (6 pins), CAN (C15.2 U4.8), Isolation (7 pins), BSPD (23 pins), Safety Loop (6 pins)
GLV+: TopLevel (P1.12), Power Supply (F1.1)
GLV-: TopLevel (P1.1 P1.11), Power Supply (5 pins)
5kW: TopLevel (P1.8), Isolation (U14.3), BSPD (U11.4)
BPSD LATCH: Isolation (U15.3), BSPD (R20.2 U8.9), Safety Loop (R31.1)
BRAKE SIG 1: TopLevel (P2.4), BSPD (R14.1)
BRAKE SIG 2: TopLevel (P2.3), BSPD (R19.1)
BSPD OK: Isolation (U15.4), BSPD (C39.2 R22.1 R26.2 U10.8), Safety Loop (R30.1)
CAN1_N: TopLevel (P1.5), CAN (C17.2 U5.2)
CAN1_P: TopLevel (P1.4), CAN (C18.2 U5.1)
CS (ADC): Isolation (U16.14), BSPD (ADC1.11 R23.1)
GL_IN: TopLevel (P1.10), Safety Loop (K1.13 P6.2 R32.2)
GL_IN_OK: Microcontroller (U7.20), Safety Loop (U13.6)
GL_OUT: TopLevel (P1.9), Safety Loop (K1.9 P6.3)
NetADC1_12: Isolation (U16.11), BSPD (ADC1.12)
NetADC1_13: Isolation (U16.13), BSPD (ADC1.13)
NetADC1_14: Isolation (U16.12), BSPD (ADC1.14)
NetR9_1: CAN (U4.3), Microcontroller (R9.1 U7.23)
NetR10_1: CAN (U4.2), Microcontroller (R10.1 U7.24)
NetR24_1: Isolation (U14.4), BSPD (5 pins)
NetR25_1: Isolation (U14.5), BSPD (R25.1 U11.10 U12.1 U12.13)
NetR34_1: Isolation (R34.1 U16.3), Microcontroller (U7.11)
NetU7_9: Isolation (U15.13), Microcontroller (U7.9)
NetU7_10: Isolation (U15.14), Microcontroller (U7.10)
NetU7_12: Isolation (U16.4), Microcontroller (U7.12)
NetU7_13: Isolation (U16.6), Microcontroller (U7.13)
NetU7_14: Isolation (U16.5), Microcontroller (U7.14)
NetU7_15: Isolation (U14.14), Microcontroller (U7.15)
NetU7_16: Isolation (U14.13), Microcontroller (U7.16)
NetU7_17: Isolation (U14.12), Microcontroller (U7.17)